# EAGLE design main (EAGLE 9.0.1)
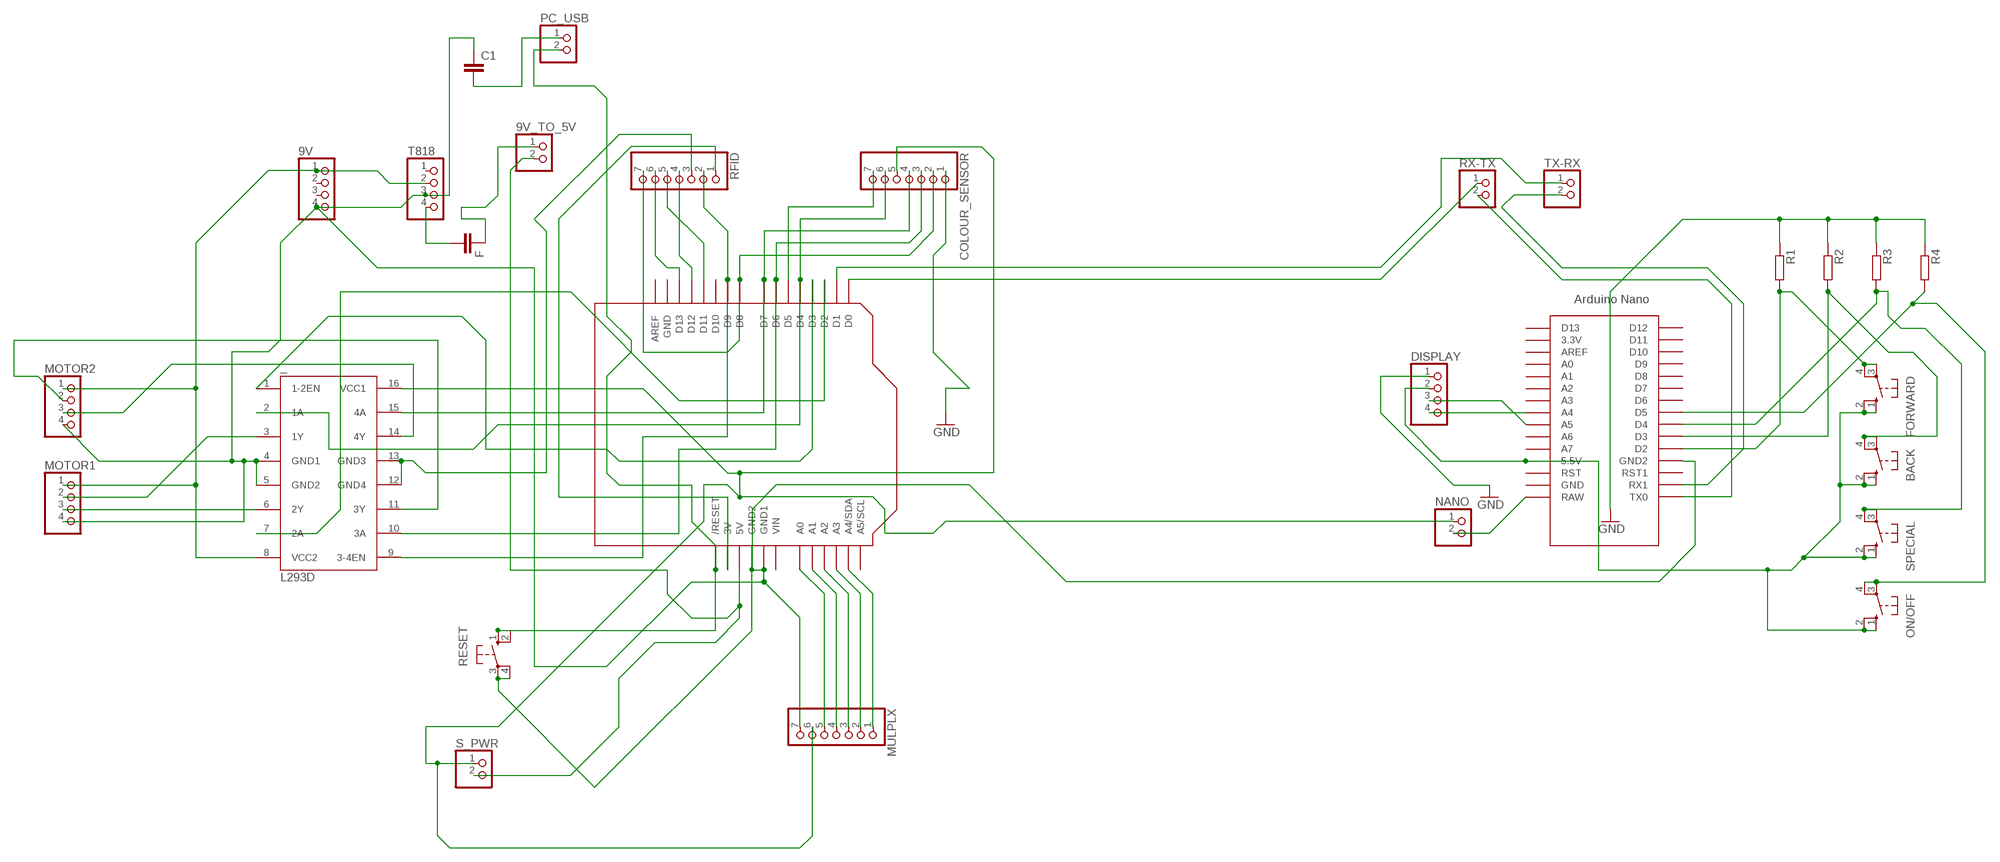
[diagram p0: schematic, sheet 1]

## Parts
9V  PINHD-1X04_2.54-S  [1X04-S]
9V_TO_5V  PINHD-1X02_2.54-S  [1X02-S]
_  L293D  [DIL16]
BACK  10-XX  [B3F-10XX]
C1  C5/7.2  [C5B7.2]
COLOUR_SENSOR  PINHD-1X07_2.54-S  [1X07-S]
DISPLAY  PINHD-1X04_2.54-S  [1X04-S]
F  CC4532  [C4532]
FORWARD  10-XX  [B3F-10XX]
MOTOR1  PINHD-1X04_2.54-S  [1X04-S]
MOTOR2  PINHD-1X04_2.54-S  [1X04-S]
MULPLX  PINHD-1X07_2.54-S  [1X07-S]
NANO  PINHD-1X02_2.54-S  [1X02-S]
ON/OFF  10-XX  [B3F-10XX]
PC_USB  PINHD-1X02_2.54-S  [1X02-S]
R1  R-EU_R0805  [R0805]
R2  R-EU_R0805  [R0805]
R3  R-EU_R0805  [R0805]
R4  R-EU_R0805  [R0805]
RESET  10-XX  [B3F-10XX]
RFID  PINHD-1X07_2.54-S  [1X07-S]
RX-TX  PINHD-1X02_2.54-S  [1X02-S]
S_PWR  PINHD-1X02_2.54-S  [1X02-S]
SPECIAL  10-XX  [B3F-10XX]
T818  PINHD-1X04_2.54-S  [1X04-S]
TX-RX  PINHD-1X02_2.54-S  [1X02-S]
U1  ARDUINOR3-DIMENSION  [ARDUINOR3]
U$1  NANO  [NANO]

## Nets
GND [supplyHigh]: 9V.4 _.4(GND1) _.5(GND2) C1.1 COLOUR_SENSOR.1 DISPLAY.1 MOTOR1.4 MOTOR2.4 MULPLX.7 R1.1 R2.1 R3.1 R4.1 RESET.3(P) RESET.4(P1) T818.3 U1.GND1 U1.GND2 U$1.GND1(GND2)
N$1: _.12(GND4) _.13(GND3) RFID.3
N$2: F.2 T818.4
N$3 [supplyHigh]: 9V_TO_5V.2 S_PWR.2 U1.5V
N$4: COLOUR_SENSOR.2 RFID.7 U1.D8
N$5: MULPLX.1 U1.A4(A4/SDA)
N$6: MULPLX.5 U1.A0
N$7: MULPLX.4 U1.A1
N$8: MULPLX.3 U1.A2
N$9: MULPLX.2 U1.A3
N$10: ON/OFF.3(P) ON/OFF.4(P1) R4.2 U$1.D5
N$11: COLOUR_SENSOR.7 U1.D5
N$12: BACK.1(S) BACK.2(S1) DISPLAY.2 FORWARD.1(S) FORWARD.2(S1) ON/OFF.1(S) ON/OFF.2(S1) SPECIAL.1(S) SPECIAL.2(S1) U$1.5V(5.5V)
N$13: PC_USB.2 RESET.1(S) RESET.2(S1) U1.RESET(/RESET)
N$14: DISPLAY.3 U$1.A5
N$15: DISPLAY.4 U$1.A4
N$16: C1.2 PC_USB.1
N$17: _.2(1A) COLOUR_SENSOR.6 U1.D4
N$20 [supplyHigh]: 9V.1 _.8(VCC2) MOTOR1.1 MOTOR2.1 T818.2
N$21: RFID.1 U1.3V
N$22: FORWARD.3(P) FORWARD.4(P1) R1.2 U$1.D2
N$23: RX-TX.1 U1.D0
N$24: RX-TX.2 U$1.TX0
N$25: TX-RX.1 U1.D1
N$26: TX-RX.2 U$1.RX1
N$27: NANO.2 U$1.RAW
N$28: BACK.3(P) BACK.4(P1) R2.2 U$1.D3
N$32: _.9(3-4EN) RFID.2 U1.D9
N$33: R3.2 SPECIAL.3(P) SPECIAL.4(P1) U$1.D4
N$34 [supplyHigh]: 9V_TO_5V.1 F.1
N$35: _.10(3A) COLOUR_SENSOR.3 U1.D6
N$36: _.15(4A) COLOUR_SENSOR.4 U1.D7
N$37: RFID.4 U1.D12
N$38: RFID.5 U1.D11
N$39: RFID.6 U1.D13
N$40 [supplyHigh]: _.16(VCC1) COLOUR_SENSOR.5 MULPLX.6 NANO.1 S_PWR.1
N$43: _.3(1Y) MOTOR1.2
N$44: _.6(2Y) MOTOR1.3
N$45: _.11(3Y) MOTOR2.2
N$46: _.14(4Y) MOTOR2.3
N$51: _.1(1-2EN) U1.D3
N$53: _.7(2A) U1.D2
Unconnected: 9V.2 9V.3 T818.1 U1.A5(A5/SCL) U1.AREF U1.D10 U$1.3.3V U$1.A0 U$1.A1 U$1.A2 U$1.A3 U$1.A6 U$1.A7 U$1.AREF U$1.D6 U$1.D7 U$1.D8 U$1.D9 U$1.D10 U$1.D11 U$1.D12 U$1.D13 U$1.GND U$1.RST U$1.RST1

## Power pins joined to a net without a drawn wire
GND: U1.GND
VIN: U1.VIN

## Library data of the parts
9V DISPLAY MOTOR1 MOTOR2 T818 = pinhead-2:PINHD-1X04: PIN HEADER
9V_TO_5V NANO PC_USB RX-TX S_PWR TX-RX = pinhead-2:PINHD-1X02: PIN HEADER
_ = st-microelectronics:L293D: PUSH-PULL 4 CHANNEL DRIVER
BACK FORWARD ON/OFF RESET SPECIAL = switch-omron:10-XX: OMRON SWITCH; MPN: B3F-1000; OC_FARNELL: 176432; OC_NEWARK: 36M3542
C1 = capacitor-wima:C: CAPACITOR naming: grid - package width
COLOUR_SENSOR MULPLX RFID = pinhead-2:PINHD-1X07: PIN HEADER
F = eagle-ltspice:C: CAPACITOR, European symbol; SPICEMODEL: NONE; SPICEPREFIX: C
R1-R4 = resistor:R-EU_: RESISTOR, European symbol
U1 = adafruit:ARDUINOR3: This is a new object for the new Arduino R3 - with extra pins that you may want to use (such as IOref, and duplicated A4/A5
U$1 = Arduino-clone:NANO: Arduino Nano

## Net classes
0 default: width 0.432 mm
1 supply: width 0.66 mm
2 supplyHigh: width 0.762 mm

## Board
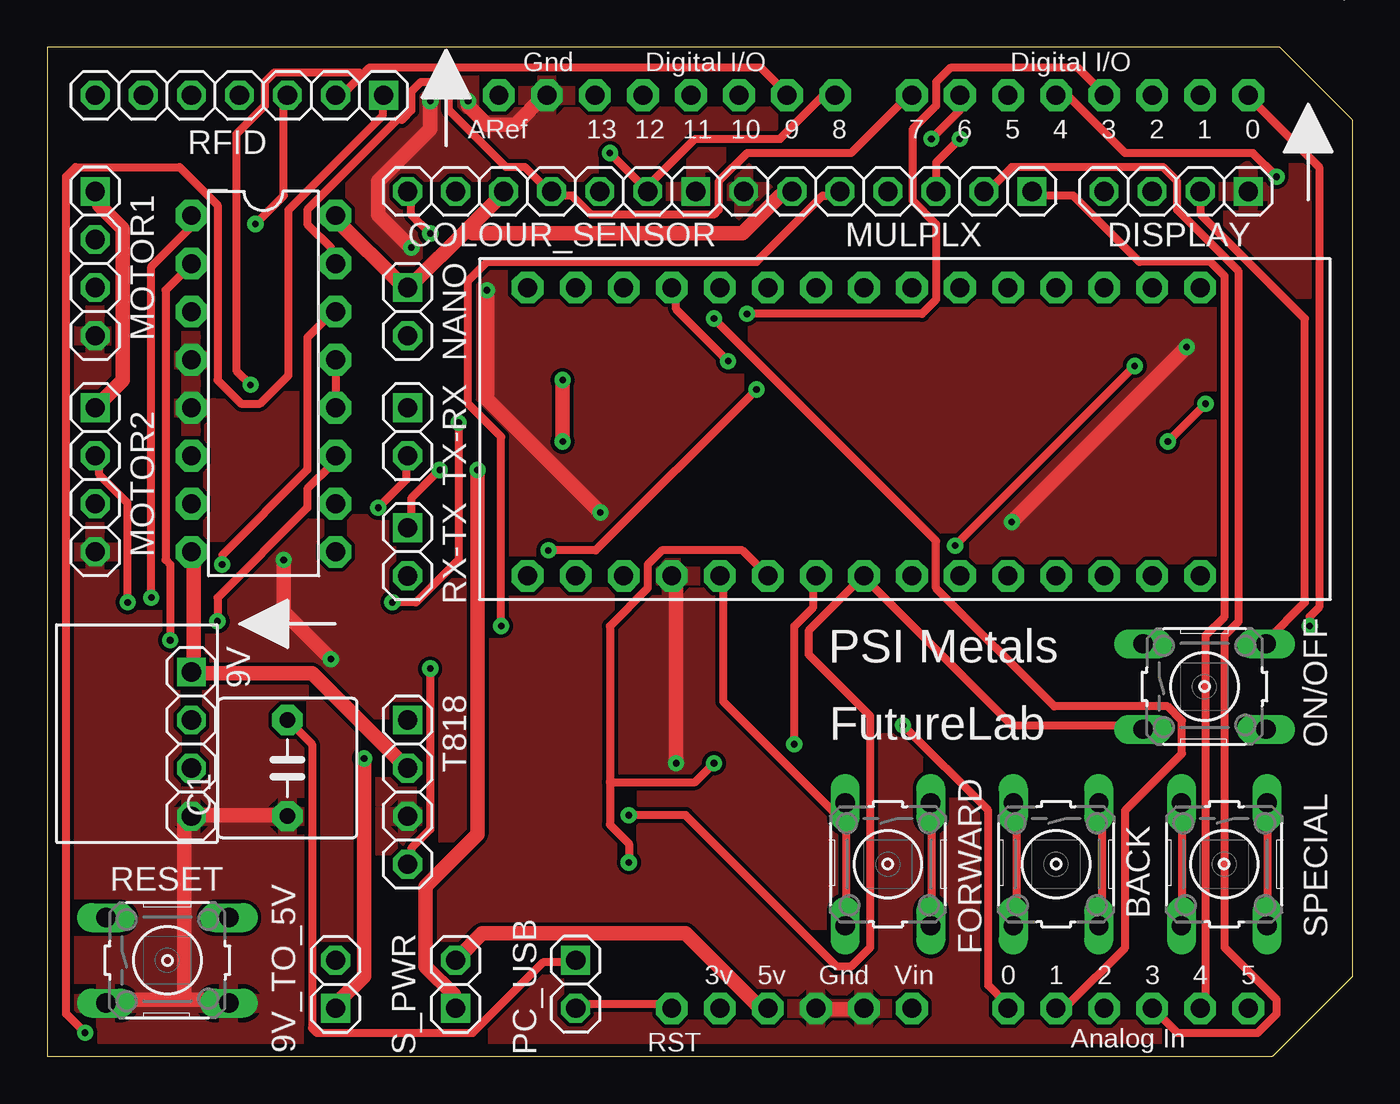
[diagram p1: board, top side]
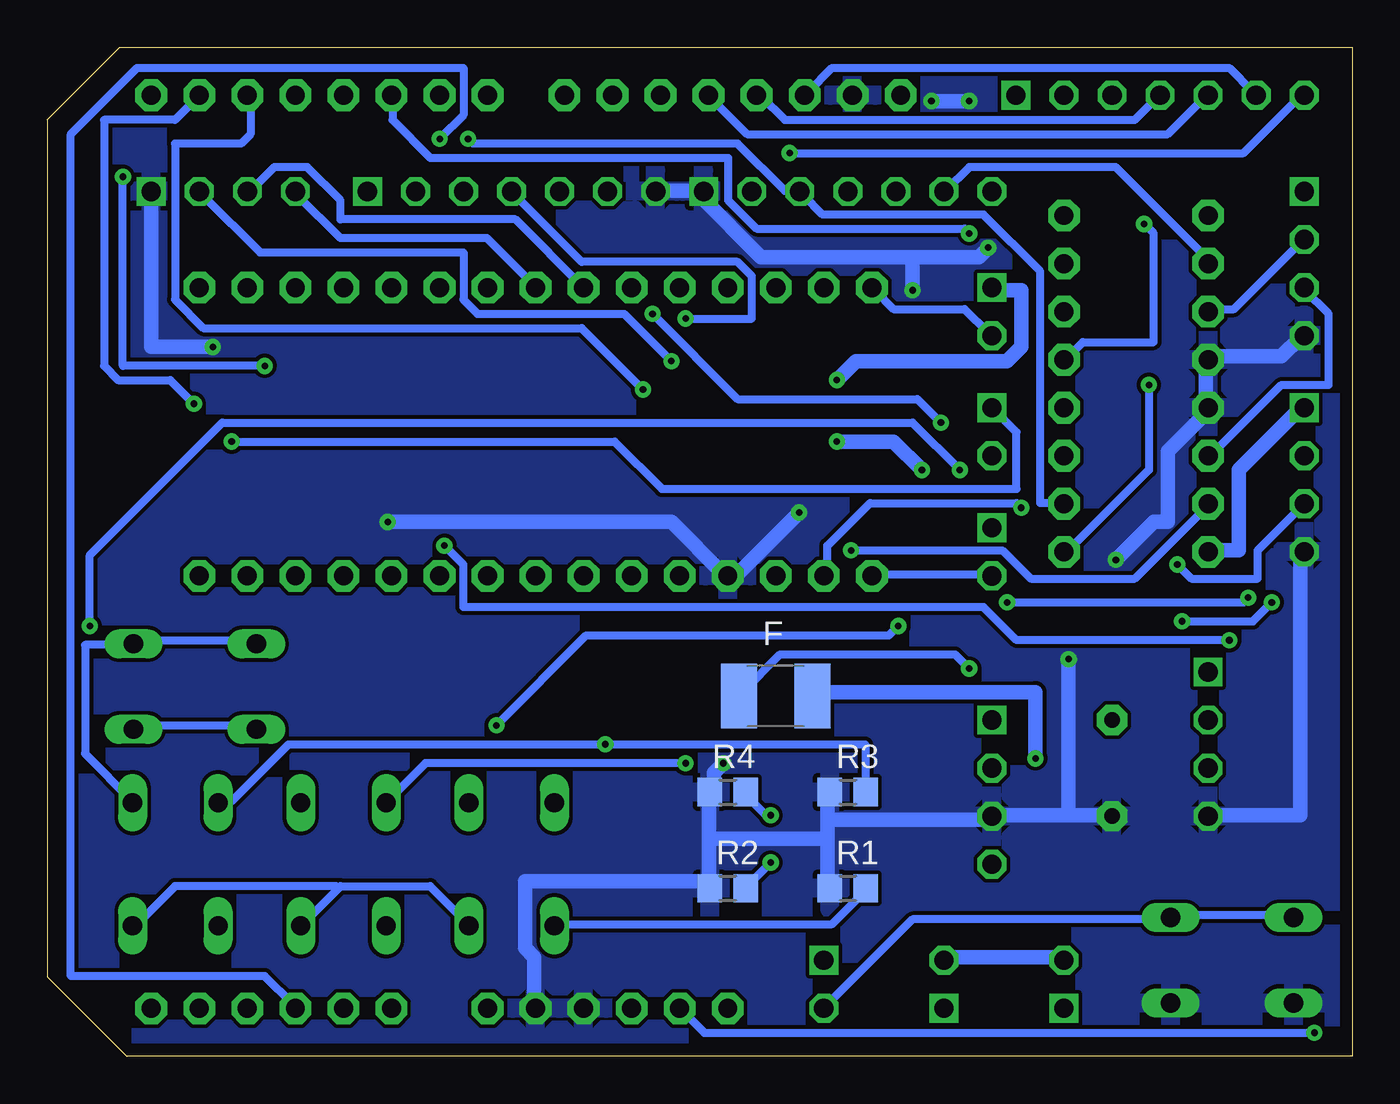
[diagram p2: board, bottom side, seen from below]

Size 69 x 53.34 mm. Coordinates in mm from the lower left corner, seen from the top.
Copper layers (1*16): Top 0.035mm / dielectric 1.5mm / Bottom 0.035mm
Design rules "default *": minimum track width 17mil, minimum drill 0.35mm, track to track 8mil, track to pad 8mil, pad to pad 8mil, via to via 12mil, smd to smd 6mil, copper to edge 26mil, drill to drill 12mil, minimum pad ring 10mil, minimum via ring 10mil, stop-mask expansion 4mil, vias tented up to drill 15mil, thermal gap 10mil

### Footprints (pad centres in the part's own frame; a part is rotated, then mirrored left to right if it is on the bottom)
1X04-S = drill 1.016 square: 1 -3.81,0 | drill 1.016 octagon: 2 -1.27,0; 3 1.27,0; 4 3.81,0
1X02-S = drill 1.016 square: 1 -1.27,0 | drill 1.016 octagon: 2 1.27,0
DIL16 = drill 1 pad 1.676 octagon: 1 -8.89,-3.81; 2 -6.35,-3.81; 3 -3.81,-3.81; 4 -1.27,-3.81; 5 1.27,-3.81; 6 3.81,-3.81; 7 6.35,-3.81; 8 8.89,-3.81; 9 8.89,3.81; 10 6.35,3.81; 11 3.81,3.81; 12 1.27,3.81; 13 -1.27,3.81; 14 -3.81,3.81; 15 -6.35,3.81; 16 -8.89,3.81
B3F-10XX = drill 1.016 long: 1 -3.251,2.261; 2 3.251,2.261; 3 -3.251,-2.261; 4 3.251,-2.261
C5B7.2 = drill 0.813 pad 1.6 octagon: 1 -2.54,0; 2 2.54,0
1X07-S = drill 1.016 square: 1 -7.62,0 | drill 1.016 octagon: 2 -5.08,0; 3 -2.54,0; 4 0,0; 5 2.54,0; 6 5.08,0; 7 7.62,0
C4532 = smd 1.9 x 3.4: 1 -1.95,0; 2 1.95,0
R0805 = smd 1.3 x 1.5: 1 -0.95,0; 2 0.95,0
ARDUINOR3 = drill 1 pad 1.676 octagon: 3V 35.56,2.54; 5V 38.1,2.54; A0 50.8,2.54; A1 53.34,2.54; A2 55.88,2.54; A3 58.42,2.54; A4 60.96,2.54; A5 63.5,2.54; AREF 23.876,50.8; D0 63.5,50.8; D1 60.96,50.8; D2 58.42,50.8; D3 55.88,50.8; D4 53.34,50.8; D5 50.8,50.8; D6 48.26,50.8; D7 45.72,50.8; D8 41.656,50.8; D9 39.116,50.8; D10 36.576,50.8; D11 34.036,50.8; D12 31.496,50.8; D13 28.956,50.8; GND 26.416,50.8; GND1 43.18,2.54; GND2 40.64,2.54; RESET 33.02,2.54; VIN 45.72,2.54
NANO = drill 1 pad 1.676 octagon: 3.3V -10.16,24.13; 5V -10.16,-1.27; A0 -10.16,19.05; A1 -10.16,16.51; A2 -10.16,13.97; A3 -10.16,11.43; A4 -10.16,8.89; A5 -10.16,6.35; A6 -10.16,3.81; A7 -10.16,1.27; AREF -10.16,21.59; D2 5.08,1.27; D3 5.08,3.81; D4 5.08,6.35; D5 5.08,8.89; D6 5.08,11.43; D7 5.08,13.97; D8 5.08,16.51; D9 5.08,19.05; D10 5.08,21.59; D11 5.08,24.13; D12 5.08,26.67; D13 -10.16,26.67; GND -10.16,-6.35; GND1 5.08,-1.27; RAW -10.16,-8.89; RST -10.16,-3.81; RST1 5.08,-3.81; RX1 5.08,-6.35; TX0 5.08,-8.89

### Placement (x,y rotation side)
9V  7.62,16.51 270 top
9V_TO_5V  15.24,3.81 90 top
_  11.43,35.56 270 top
BACK  53.34,10.16 270 top
C1  12.7,15.24 90 top
COLOUR_SENSOR  26.67,45.72 180 top
DISPLAY  59.69,45.72 180 top
F  30.48,19.05 180 bottom
FORWARD  44.45,10.16 270 top
MOTOR1  2.54,41.91 270 top
MOTOR2  2.54,30.48 270 top
MULPLX  44.45,45.72 180 top
NANO  19.05,39.37 270 top
ON/OFF  61.19,19.55 0 top
PC_USB  27.94,3.81 270 top
R1  26.67,8.89 0 bottom
R2  33.02,8.89 0 bottom
R3  26.67,13.97 0 bottom
R4  33.02,13.97 0 bottom
RESET  6.35,5.08 0 top
RFID  10.16,50.8 180 top
RX-TX  19.05,26.67 270 top
S_PWR  21.59,3.81 90 top
SPECIAL  62.23,10.16 270 top
T818  19.05,13.97 270 top
TX-RX  19.05,33.02 270 top
U1  0,0 0 top
U$1  34.29,30.48 270 top

### Tracks (layer width: path | path; a pad name or v marks a point on that pad's centre or on a via)
GND  (via drill 0.35)
  Top 0.762: v22.25,50.5 22.25,50.25 23.25,49.25 24.75,49.25 26.25,50.75 U1.GND | v20.25,50.5 20.25,49 17.5,46.25 17.5,44.5 v19.25,42.75 | v51,28.25 v60.25,37.5 | v23.25,40.5 23.25,34.75 v29.25,28.75 | U1.GND2 40.75,2.5 43,2.5 U1.GND1 | 7.25,3 9.5,3 RESET.4 | 7.25,3 3.25,3 RESET.3 | 7.25,3 7.25,12.25 7.5,12.5 9V.4 8,12.75 12.5,12.75 C1.1 | v12.5,26.25 12.5,23.5 v15,21 | v33.25,15.5 33.25,25.25 U$1.GND1
  Bottom 0.762: MULPLX.7 36.75,45.75 34.5,45.75 COLOUR_SENSOR.1 34.5,45.5 31.25,42.25 23.25,42.25 | v20.25,50.5 v22.25,50.5 | v19.25,42.75 19.75,42.25 23.25,42.25 | DISPLAY.1 63.5,37.5 v60.25,37.5 | v51,28.25 36,28.25 33.25,25.5 U$1.GND1 32.75,25.5 32.5,25.5 v29.25,28.75 | v23.25,40.5 23.25,42.25 | 27.75,12.5 27.75,13.75 R3.1 | 27.75,12.5 27.75,11.5 | 27.75,11.5 27.75,9 R1.1 | 34,11.5 34,13.75 R4.1 33.75,14.25 33.75,15 v33.25,15.5 | 34,11.5 34,9 R2.1 34.25,9.25 43.75,9.25 43.75,5.75 43.25,5.25 43.25,2.75 U1.GND1 | 34,11.5 27.75,11.5 | MOTOR1.4 2.75,38 3.75,37 7.5,37 _.4 7.75,36.5 7.75,34.5 _.5 7.75,34 9.75,32 9.75,28.25 10.5,28.25 v12.5,26.25 | 15,12.75 12.75,12.75 C1.1 | 15,12.75 19,12.75 T818.3 19.25,12.5 27.75,12.5 | MOTOR2.4 2.75,26.5 2.75,12.75 7.5,12.75 9V.4 | 15,12.75 v15,21
  pour Top: 0,53.34 64.77,53.34 68.58,49.53 68.58,3.81 64.77,0 0,0
  pour Bottom: 0,53.34 64.77,53.34 68.58,49.53 68.58,3.81 64.77,0 0,0
N$1  (via drill 0.35)
  Top 0.432: v11,44 12.5,45.5 12.5,50.75 RFID.3 | _.12 15.25,34.5 15.25,36.75 _.13
  Bottom 0.432: v11,44 10.5,43.5 10.5,37.75 14.25,37.75 15,37 _.13
N$2  (via drill 0.35)
  Top 0.432: v20.25,20.5 20.25,12 19.25,11 19.25,10.25 T818.4
  Bottom 0.432: v20.25,20.5 21,21.25 30.25,21.25 32.25,19.25 F.2
N$3
  Top 0.762: U1.5V 38,2.75 37.5,2.75 33.75,6.5 23,6.5 21.75,5.25 S_PWR.2
  Bottom 0.762: 9V_TO_5V.2 15.25,5.25 21.5,5.25 S_PWR.2
N$4  (via drill 0.35)
  Top 0.432: v29.75,47.75 31.75,45.75 COLOUR_SENSOR.2 31.75,46 34.25,48.5 38.75,48.5 41,50.75 41.5,50.75 U1.D8
  Bottom 0.432: v29.75,47.75 5.75,47.75 2.75,50.75 RFID.7
N$5
  Top 0.432: MULPLX.1 52.25,45.5 54.25,45.5 57.75,42 61.5,42 62.25,41.25 62.25,23.25 61.25,22.25 61.25,3 61,2.75 U1.A4
N$6  (via drill 0.35)
  Top 0.432: v24,22.75 24,32.75 22.25,34.5 22.25,41 23.25,42 37.5,42 41,45.5 41.75,45.5 MULPLX.5 | v45.25,17.5 49.75,13 49.75,3.75 50.75,2.75 U1.A0
  Bottom 0.432: v24,22.75 24.5,22.25 40.5,22.25 v45.25,17.5
N$7  (via drill 0.35)
  Top 0.432: v35.25,39 47,27.25 47,24.75 53.25,18.5 59.25,18.5 60,17.75 60,16 57,13 57,5.75 54,2.75 53.5,2.75 U1.A1
  Bottom 0.432: v35.25,39 31.75,39 31.75,41.25 32.5,42 40.75,42 44.25,45.5 MULPLX.4
N$8  (via drill 0.35)
  Top 0.432: v48.25,48.5 47,47.25 47,45.75 MULPLX.3
  Bottom 0.432: v48.25,48.5 47,49.75 47,52.25 64.25,52.25 67.75,48.75 67.75,4.25 57.5,4.25 56,2.75 U1.A2
N$9
  Top 0.432: MULPLX.2 49.75,45.75 51,47 59,47 59.75,46.25 59.75,44.75 63,41.5 63,23 62.25,22.25 62.25,5.75 65,3 65,2.25 64,1.25 59.75,1.25 58.5,2.5 U1.A3
N$10  (via drill 0.35)
  Top 0.432: v30.75,12.75 33.75,12.75 41.75,4.75 42.5,4.75 43.5,5.75 43.5,18 40.25,21.25 40.25,22.5 43,25.25 U$1.D5 43.25,25.25 51,17.5 57.75,17.5 ON/OFF.3
  Bottom 0.432: ON/OFF.3 58,17.5 64.25,17.5 ON/OFF.4 | v30.75,12.75 31,12.75 32,13.75 R4.2
N$11  (via drill 0.35)
  Top 0.432: v20.25,43.5 19.25,44.5 19.25,45.5 COLOUR_SENSOR.7
  Bottom 0.432: v20.25,43.5 20.5,43.75 31.5,43.75 33,45.25 33,47.5 48.75,47.5 50.75,49.5 50.75,50.75 U1.D5
N$12  (via drill 0.35)
  Top 0.432: SPECIAL.2 64.5,7 64.5,13.25 SPECIAL.1 | FORWARD.2 46.75,7 46.75,13.25 FORWARD.1 | BACK.2 55.75,7 55.75,13.25 BACK.1 | DISPLAY.2 61,45.5 61,44.5 66.5,39 66.5,24 64.5,22 ON/OFF.2 | v36,36.75 33.25,39.5 33.25,40.5 U$1.5V
  Bottom 0.432: 53.62,8.88 55.5,7 BACK.2 | 53.62,8.88 53.5,9 48.75,9 46.75,7 FORWARD.2 | SPECIAL.2 64.25,7 62.25,9 53.75,9 53.62,8.88 | ON/OFF.1 58,22 64.25,22 ON/OFF.2 64.5,21.75 67,21.75 67,16 64.5,13.5 SPECIAL.1 | v36,36.75 38.5,39.25 46.25,39.25 47,40 47,42.5 57.75,42.5 60.75,45.5 DISPLAY.2
N$13
  Top 0.432: PC_USB.2 28,2.75 33,2.75 U1.RESET
  Bottom 0.432: RESET.1 3.25,7.5 9.5,7.5 RESET.2 9.75,7.25 23.25,7.25 27.75,2.75 PC_USB.2
N$14
  Bottom 0.432: U$1.A5 44.25,44.25 53.5,44.25 53.5,45.25 55.25,47 57,47 58.25,45.75 DISPLAY.3
N$15
  Bottom 0.432: DISPLAY.4 55.75,45.5 53.5,43.25 45.75,43.25 43.25,40.75 U$1.A4
N$16
  Top 0.432: PC_USB.1 27.75,5 26.25,5 22.5,1.25 14.25,1.25 14,1.5 14,16.5 12.75,17.75 C1.2
N$17  (via drill 0.35)
  Top 0.432: v65,46.5 63.75,47.75 57,47.75 54,50.75 53.5,50.75 U1.D4 | v48,27 v57.5,36.5 | v6.5,22 6.5,26 6.25,26.25 6.25,40.5 7.5,41.75 _.2
  Bottom 0.432: COLOUR_SENSOR.6 21.5,45.75 20.25,47 12.5,47 7.5,42 _.2 | v65,46.5 65,36.5 v57.5,36.5 | v48,27 47,26 47,23.75 19.5,23.75 17.75,22 v6.5,22
N$20
  Top 0.762: MOTOR2.1 4,35.75 4,43.75 2.75,45 2.75,45.5 MOTOR1.1 | _.8 7.75,26.5 7.75,20.5 9V.1 8,20.25 14,20.25 19,15.25 T818.2
  Bottom 0.762: MOTOR2.1 2.75,34.25 6,31 6,26.75 7.5,26.75 _.8
N$21  (via drill 0.35)
  Top 0.432: v2,1.25 1,2.25 1,46.5 1.5,47 7,47 9,45 9,35.75 10.25,34.5 11.25,34.5 12.75,36 12.75,44.75 17.75,49.75 17.75,50.75 RFID.1
  Bottom 0.432: v2,1.25 34.25,1.25 35.5,2.5 U1.3V
N$22
  Top 0.432: 42.25,12.25 42.25,7 FORWARD.4 | 42.25,12.25 42.25,13.25 FORWARD.3 42.25,12.25 | 42.25,12.25 35.75,18.75 35.75,25.25 U$1.D2
  Bottom 0.432: R1.2 25.75,8.75 27.5,7 42,7 FORWARD.4
N$23  (via drill 0.35)
  Top 0.432: v20.75,31 19.25,29.5 19.25,28 RX-TX.1 | v66.75,22.75 66.75,23.25 67.25,23.75 67.25,47 63.5,50.75 U1.D0
  Bottom 0.432: v20.75,31 23.25,33.5 59.75,33.5 66.75,26.5 v66.75,22.75
N$24
  Bottom 0.432: RX-TX.2 19.25,25.5 25.25,25.5 U$1.TX0
N$25  (via drill 0.35)
  Top 0.432: v61.25,34.5 v59.25,32.5
  Bottom 0.432: v59.25,32.5 39,32.5 36.5,30 17.75,30 17.75,33 19,34.25 TX-RX.1 | v61.25,34.5 62.5,35.75 65.25,35.75 66,36.5 66,49.5 62.25,49.5 61,50.75 U1.D1
N$26  (via drill 0.35)
  Top 0.432: v17.5,29 19,30.5 19,31.75 TX-RX.2
  Bottom 0.432: v17.5,29 17.75,29.25 25.5,29.25 27.75,27 27.75,25.5 U$1.RX1
N$27
  Bottom 0.432: NANO.2 19.25,38.25 20.5,39.5 24.25,39.5 25.25,40.5 U$1.RAW
N$28  (via drill 0.35)
  Top 0.432: BACK.4 51.25,7 51.25,13.25 BACK.3 | v30.75,10.25 30.75,11.25 29.75,12.25 29.75,14.5 | 29.75,14.5 29.75,22.75 31.75,24.75 31.75,26 32.5,26.75 36.75,26.75 U$1.D3 | v35.25,15.5 34.25,14.5 29.75,14.5
  Bottom 0.432: v30.75,10.25 32,9 R2.2 | v35.25,15.5 49,15.5 51,13.5 BACK.3
N$32  (via drill 0.35)
  Top 0.432: 16.62,51.88 17,52.25 37.75,52.25 39,51 U1.D9 | 16.62,51.88 15.75,51 15.25,51 RFID.2 | v10.75,35.5 10,36.25 10,48.75 11.5,50.25 11.5,51.5 12,52 16.5,52 16.62,51.88
  Bottom 0.432: v10.75,35.5 10.75,31 15,26.75 _.9
N$33  (via drill 0.35)
  Top 0.432: SPECIAL.4 60,7 60,13.25 SPECIAL.3 | v39.5,16.5 39.5,22.75 40.5,23.75 40.5,25.25 U$1.D4
  Bottom 0.432: R3.2 25.75,14 25.75,16.5 v39.5,16.5 56.25,16.5 59.25,13.5 59.75,13.5 SPECIAL.3
N$34  (via drill 0.35)
  Top 0.762: v16.75,15.75 16.75,4.25 15.25,2.75 9V_TO_5V.1
  Bottom 0.762: v16.75,15.75 16.75,19.25 28.5,19.25 F.1
N$35  (via drill 0.35)
  Top 0.432: v46.75,48.5 48.25,50 48.25,50.75 U1.D6
  Bottom 0.432: _.10 15.25,29.25 16.5,29.25 16.5,41.5 19.5,44.5 28,44.5 29,45.5 COLOUR_SENSOR.3 29.25,45.75 30,45.75 32.5,48.25 46.5,48.25 v46.75,48.5
N$36
  Top 0.432: U1.D7 45.5,50.75 42.5,47.75 37,47.75 35.5,46.25 35.5,44.75 35.25,44.5 28.75,44.5 27.75,45.5 26.75,45.5 COLOUR_SENSOR.4 26.5,45.75 25.25,47 24.25,47 21.25,50 21.25,51 20.75,51.5 19.75,51.5 19.25,51 19.25,50 18.75,49.5 18.5,49.5 13.75,44.75 13.75,44 15,42.75 15,42 _.15
N$37
  Bottom 0.432: RFID.4 10.25,50.75 11.5,49.5 30,49.5 31.25,50.75 U1.D12
N$38
  Bottom 0.432: RFID.5 7.75,50.75 9.75,48.75 32,48.75 34,50.75 U1.D11
N$39
  Bottom 0.432: RFID.6 5.25,51 6.5,52.25 27.5,52.25 28.75,51 U1.D13
N$40  (via drill 0.35)
  Top 0.762: v22.75,31 22.75,11.75 20,9 20,4.75 21.5,3.25 21.5,2.75 S_PWR.1 | v27.25,35.75 v27.25,32.5 | 22.25,43.75 19.25,40.75 NANO.1 18.75,40.75 15.25,44.25 _.16 | 22.25,43.75 24,45.5 COLOUR_SENSOR.5 | MULPLX.6 39.25,45.5 38.75,45.5 36.75,43.5 22.5,43.5 22.25,43.75
  Bottom 0.762: v22.75,31 24.25,32.5 v27.25,32.5 | v27.25,35.75 26.25,36.75 18.25,36.75 17.5,37.5 17.5,40.5 19,40.5 NANO.1
N$43
  Bottom 0.432: MOTOR1.2 2.75,43 6.25,39.5 7.5,39.5 _.3
N$44
  Bottom 0.432: MOTOR1.3 2.5,40.5 1.25,39.25 1.25,35.5 3.75,35.5 7.5,31.75 _.6
N$45  (via drill 0.35)
  Top 0.432: v4.25,24 4.25,29.25 2.75,30.75 2.75,31.75 MOTOR2.2 | v9,23 9,24.25 13.75,29 13.75,30 15,31.25 15,31.75 _.11
  Bottom 0.432: v4.25,24 5.25,23 v9,23
N$46  (via drill 0.35)
  Top 0.432: v9.25,26 9.25,26.5 13.75,31 13.75,38 15,39.25 _.14
  Bottom 0.432: MOTOR2.3 5,26.75 5,25.25 8.5,25.25 v9.25,26
N$51  (via drill 0.35)
  Top 0.432: v5.5,24.25 5.5,41.75 7.5,43.75 7.5,44.25 _.1 | v18.25,24 19.5,24 21.75,26.25 v21.75,33.5 | v37,39.25 46.25,39.25 47,40 47,44 45.75,45.25 45.75,49 47,50.25 47,51.5 47.75,52.25 54.5,52.25 55.75,51 U1.D3
  Bottom 0.432: v5.5,24.25 5.75,24 v18.25,24 | v21.75,33.5 23,34.75 32.5,34.75 v37,39.25
N$53  (via drill 0.35)
  Top 0.432: v26.5,26.75 29,26.75 v37.5,35.25
  Bottom 0.432: v26.5,26.75 18.5,26.75 17,25.25 11.5,25.25 7.75,29 _.7 | v37.5,35.25 40.75,38.5 60.75,38.5 62.25,40 62.25,48.25 58.75,48.25 58.25,48.75 58.25,50.75 U1.D2

### Text on the board
tPlace: PSI Metals | FutureLab